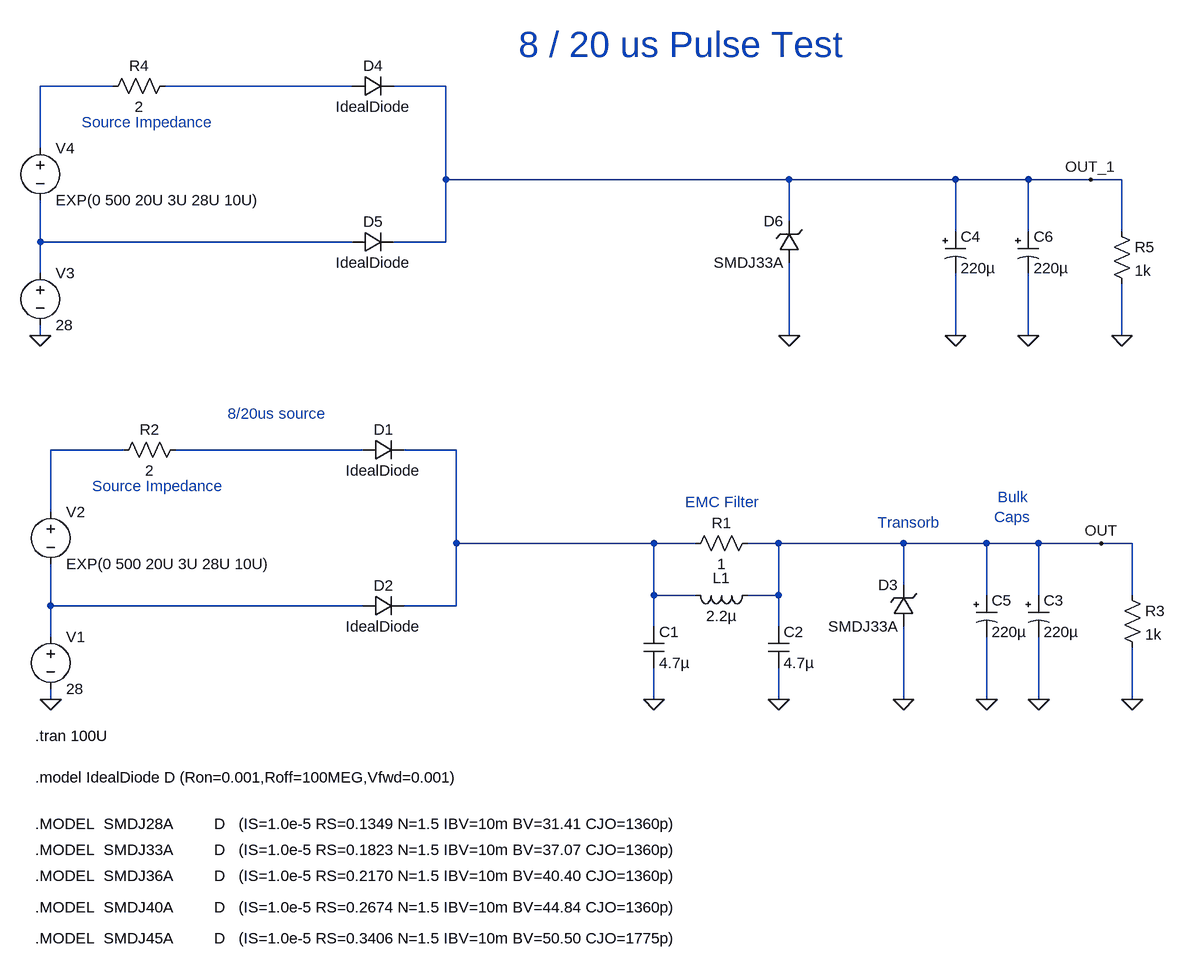
[diagram p0: schematic 8-20us pulse.asc]
8-20us pulse.asc, the LTspice schematic file:
Version 4
SHEET 1 1352 680
WIRE -560 -704 -672 -704
WIRE -192 -704 -480 -704
WIRE -48 -704 -128 -704
WIRE -672 -608 -672 -704
WIRE -48 -560 -48 -704
WIRE 480 -560 -48 -560
WIRE 736 -560 480 -560
WIRE 848 -560 736 -560
WIRE 944 -560 848 -560
WIRE 992 -560 944 -560
WIRE 480 -496 480 -560
WIRE 736 -480 736 -560
WIRE 848 -480 848 -560
WIRE 992 -480 992 -560
WIRE -672 -464 -672 -528
WIRE -192 -464 -672 -464
WIRE -48 -464 -48 -560
WIRE -48 -464 -128 -464
WIRE -672 -416 -672 -464
WIRE -672 -320 -672 -336
WIRE 480 -320 480 -432
WIRE 736 -320 736 -416
WIRE 848 -320 848 -416
WIRE 992 -320 992 -400
WIRE -544 -144 -656 -144
WIRE -176 -144 -464 -144
WIRE -32 -144 -112 -144
WIRE -656 -48 -656 -144
WIRE -32 0 -32 -144
WIRE 272 0 -32 0
WIRE 336 0 272 0
WIRE 464 0 416 0
WIRE 656 0 464 0
WIRE 784 0 656 0
WIRE 864 0 784 0
WIRE 960 0 864 0
WIRE 1008 0 960 0
WIRE 656 64 656 0
WIRE 272 80 272 0
WIRE 336 80 272 80
WIRE 464 80 464 0
WIRE 464 80 416 80
WIRE 784 80 784 0
WIRE 864 80 864 0
WIRE 1008 80 1008 0
WIRE -656 96 -656 32
WIRE -176 96 -656 96
WIRE -32 96 -32 0
WIRE -32 96 -112 96
WIRE 272 128 272 80
WIRE 464 128 464 80
WIRE -656 144 -656 96
WIRE -656 240 -656 224
WIRE 272 240 272 192
WIRE 464 240 464 192
WIRE 656 240 656 128
WIRE 784 240 784 144
WIRE 864 240 864 144
WIRE 1008 240 1008 160
FLAG 272 240 0
FLAG 464 240 0
FLAG -656 240 0
FLAG 1008 240 0
FLAG 960 0 OUT
FLAG 656 240 0
FLAG 864 240 0
FLAG -672 -320 0
FLAG 992 -320 0
FLAG 944 -560 OUT_1
FLAG 480 -320 0
FLAG 848 -320 0
FLAG 736 -320 0
FLAG 784 240 0
SYMBOL cap 256 128 R0
SYMATTR InstName C1
SYMATTR Value 4.7µ
SYMATTR SpiceLine V=100 Irms=0 Rser=0.003 Lser=0 mfg="TDK" pn="C5750X7R2A475M" type="X7R"
SYMBOL cap 448 128 R0
SYMATTR InstName C2
SYMATTR Value 4.7µ
SYMATTR SpiceLine V=100 Irms=0 Rser=0.003 Lser=0 mfg="TDK" pn="C5750X7R2A475M" type="X7R"
SYMBOL ind 432 64 R90
WINDOW 0 5 56 VBottom 2
WINDOW 3 32 56 VTop 2
SYMATTR InstName L1
SYMATTR Value 2.2µ
SYMATTR SpiceLine Ipk=10 Rser=0.013 Rpar=0 Cpar=0 mfg="Vishay" pn="IHLP2525EZ01-2R2"
SYMBOL voltage -656 128 R0
WINDOW 123 0 0 Left 2
WINDOW 39 0 0 Left 2
SYMATTR InstName V1
SYMATTR Value 28
SYMBOL voltage -656 -64 R0
WINDOW 123 0 0 Left 2
WINDOW 39 0 0 Left 2
SYMATTR InstName V2
SYMATTR Value EXP(0 500 20U 3U 28U 10U)
SYMBOL res -448 -160 R90
WINDOW 0 0 56 VBottom 2
WINDOW 3 32 56 VTop 2
SYMATTR InstName R2
SYMATTR Value 2
SYMBOL diode -176 -128 R270
WINDOW 0 32 32 VTop 2
WINDOW 3 0 32 VBottom 2
SYMATTR InstName D1
SYMATTR Value IdealDiode
SYMBOL diode -176 112 R270
WINDOW 0 32 32 VTop 2
WINDOW 3 0 32 VBottom 2
SYMATTR InstName D2
SYMATTR Value IdealDiode
SYMBOL res 992 64 R0
SYMATTR InstName R3
SYMATTR Value 1k
SYMBOL res 432 -16 R90
WINDOW 0 0 56 VBottom 2
WINDOW 3 32 56 VTop 2
SYMATTR InstName R1
SYMATTR Value 1
SYMBOL polcap 848 80 R0
WINDOW 3 24 56 Left 2
SYMATTR InstName C3
SYMATTR Value 220µ
SYMATTR Description Capacitor
SYMATTR Type cap
SYMATTR SpiceLine V=50 Irms=750m Rser=0.16 Lser=0 mfg="Nichicon" pn="UPG1H221MPH" type="Al electrolytic"
SYMBOL zener 672 128 R180
WINDOW 0 24 64 Left 2
WINDOW 3 24 0 Left 2
SYMATTR InstName D3
SYMATTR Value SMDJ33A
SYMATTR Description Diode
SYMATTR Type diode
SYMBOL voltage -672 -432 R0
WINDOW 123 0 0 Left 2
WINDOW 39 0 0 Left 2
SYMATTR InstName V3
SYMATTR Value 28
SYMBOL voltage -672 -624 R0
WINDOW 123 0 0 Left 2
WINDOW 39 0 0 Left 2
SYMATTR InstName V4
SYMATTR Value EXP(0 500 20U 3U 28U 10U)
SYMBOL res -464 -720 R90
WINDOW 0 0 56 VBottom 2
WINDOW 3 32 56 VTop 2
SYMATTR InstName R4
SYMATTR Value 2
SYMBOL diode -192 -688 R270
WINDOW 0 32 32 VTop 2
WINDOW 3 0 32 VBottom 2
SYMATTR InstName D4
SYMATTR Value IdealDiode
SYMBOL diode -192 -448 R270
WINDOW 0 32 32 VTop 2
WINDOW 3 0 32 VBottom 2
SYMATTR InstName D5
SYMATTR Value IdealDiode
SYMBOL res 976 -496 R0
SYMATTR InstName R5
SYMATTR Value 1k
SYMBOL polcap 832 -480 R0
WINDOW 3 24 56 Left 2
SYMATTR InstName C6
SYMATTR Value 220µ
SYMATTR Description Capacitor
SYMATTR Type cap
SYMATTR SpiceLine V=50 Irms=750m Rser=0.16 Lser=0 mfg="Nichicon" pn="UPG1H221MPH" type="Al electrolytic"
SYMBOL zener 496 -432 R180
WINDOW 0 24 64 Left 2
WINDOW 3 24 0 Left 2
SYMATTR InstName D6
SYMATTR Value SMDJ33A
SYMATTR Description Diode
SYMATTR Type diode
SYMBOL polcap 720 -480 R0
WINDOW 3 24 56 Left 2
SYMATTR InstName C4
SYMATTR Value 220µ
SYMATTR Description Capacitor
SYMATTR Type cap
SYMATTR SpiceLine V=50 Irms=750m Rser=0.16 Lser=0 mfg="Nichicon" pn="UPG1H221MPH" type="Al electrolytic"
SYMBOL polcap 768 80 R0
WINDOW 3 24 56 Left 2
SYMATTR InstName C5
SYMATTR Value 220µ
SYMATTR Description Capacitor
SYMATTR Type cap
SYMATTR SpiceLine V=50 Irms=750m Rser=0.16 Lser=0 mfg="Nichicon" pn="UPG1H221MPH" type="Al electrolytic"
TEXT -680 296 Left 2 !.tran 100U
TEXT -592 -88 Left 2 ;Source Impedance
TEXT -680 360 Left 2 !.model IdealDiode D (Ron=0.001,Roff=100MEG,Vfwd=0.001)
TEXT -680 432 Left 2 !.MODEL  SMDJ28A         D   (IS=1.0e-5 RS=0.1349 N=1.5 IBV=10m BV=31.41 CJO=1360p)
TEXT -680 472 Left 2 !.MODEL  SMDJ33A         D   (IS=1.0e-5 RS=0.1823 N=1.5 IBV=10m BV=37.07 CJO=1360p)
TEXT -680 512 Left 2 !.MODEL  SMDJ36A         D   (IS=1.0e-5 RS=0.2170 N=1.5 IBV=10m BV=40.40 CJO=1360p)
TEXT -680 560 Left 2 !.MODEL  SMDJ40A         D   (IS=1.0e-5 RS=0.2674 N=1.5 IBV=10m BV=44.84 CJO=1360p)
TEXT -680 608 Left 2 !.MODEL  SMDJ45A         D   (IS=1.0e-5 RS=0.3406 N=1.5 IBV=10m BV=50.50 CJO=1775p)
TEXT -608 -648 Left 2 ;Source Impedance
TEXT 320 -64 Left 2 ;EMC Filter
TEXT 616 -32 Left 2 ;Transorb
TEXT 824 -56 Center 2 ;Bulk\nCaps
TEXT -384 -200 Left 2 ;8/20us source
TEXT 64 -768 Left 5 ;8 / 20 us Pulse Test

The netlist it stands for:
* 8-20us pulse.asc
C1 N006 0 4.7µ V=100 Irms=0 Rser=0.003 Lser=0 mfg="TDK" pn="C5750X7R2A475M" type="X7R"
C2 OUT 0 4.7µ V=100 Irms=0 Rser=0.003 Lser=0 mfg="TDK" pn="C5750X7R2A475M" type="X7R"
L1 OUT N006 2.2µ Ipk=10 Rser=0.013 Rpar=0 Cpar=0 mfg="Vishay" pn="IHLP2525EZ01-2R2"
V1 N007 0 28
V2 N004 N007 EXP(0 500 20U 3U 28U 10U)
R2 N005 N004 2
D1 N005 N006 IdealDiode
D2 N007 N006 IdealDiode
R3 OUT 0 1k
R1 OUT N006 1
C3 OUT 0 220µ V=50 Irms=750m Rser=0.16 Lser=0 mfg="Nichicon" pn="UPG1H221MPH" type="Al electrolytic"
D3 0 OUT SMDJ33A
V3 N003 0 28
V4 N001 N003 EXP(0 500 20U 3U 28U 10U)
R4 N002 N001 2
D4 N002 OUT_1 IdealDiode
D5 N003 OUT_1 IdealDiode
R5 OUT_1 0 1k
C6 OUT_1 0 220µ V=50 Irms=750m Rser=0.16 Lser=0 mfg="Nichicon" pn="UPG1H221MPH" type="Al electrolytic"
D6 0 OUT_1 SMDJ33A
C4 OUT_1 0 220µ V=50 Irms=750m Rser=0.16 Lser=0 mfg="Nichicon" pn="UPG1H221MPH" type="Al electrolytic"
C5 OUT 0 220µ V=50 Irms=750m Rser=0.16 Lser=0 mfg="Nichicon" pn="UPG1H221MPH" type="Al electrolytic"
.model D D
.lib standard.dio
.tran 100U
* Source Impedance
.model IdealDiode D (Ron=0.001,Roff=100MEG,Vfwd=0.001)
.MODEL  SMDJ28A         D   (IS=1.0e-5 RS=0.1349 N=1.5 IBV=10m BV=31.41 CJO=1360p)
.MODEL  SMDJ33A         D   (IS=1.0e-5 RS=0.1823 N=1.5 IBV=10m BV=37.07 CJO=1360p)
.MODEL  SMDJ36A         D   (IS=1.0e-5 RS=0.2170 N=1.5 IBV=10m BV=40.40 CJO=1360p)
.MODEL  SMDJ40A         D   (IS=1.0e-5 RS=0.2674 N=1.5 IBV=10m BV=44.84 CJO=1360p)
.MODEL  SMDJ45A         D   (IS=1.0e-5 RS=0.3406 N=1.5 IBV=10m BV=50.50 CJO=1775p)
* Source Impedance
* EMC Filter
* Transorb
* Bulk
* Caps
* 8/20us source
* 8 / 20 us Pulse Test
.backanno
.end